# EAGLE design NESv23 (EAGLE 5.11)
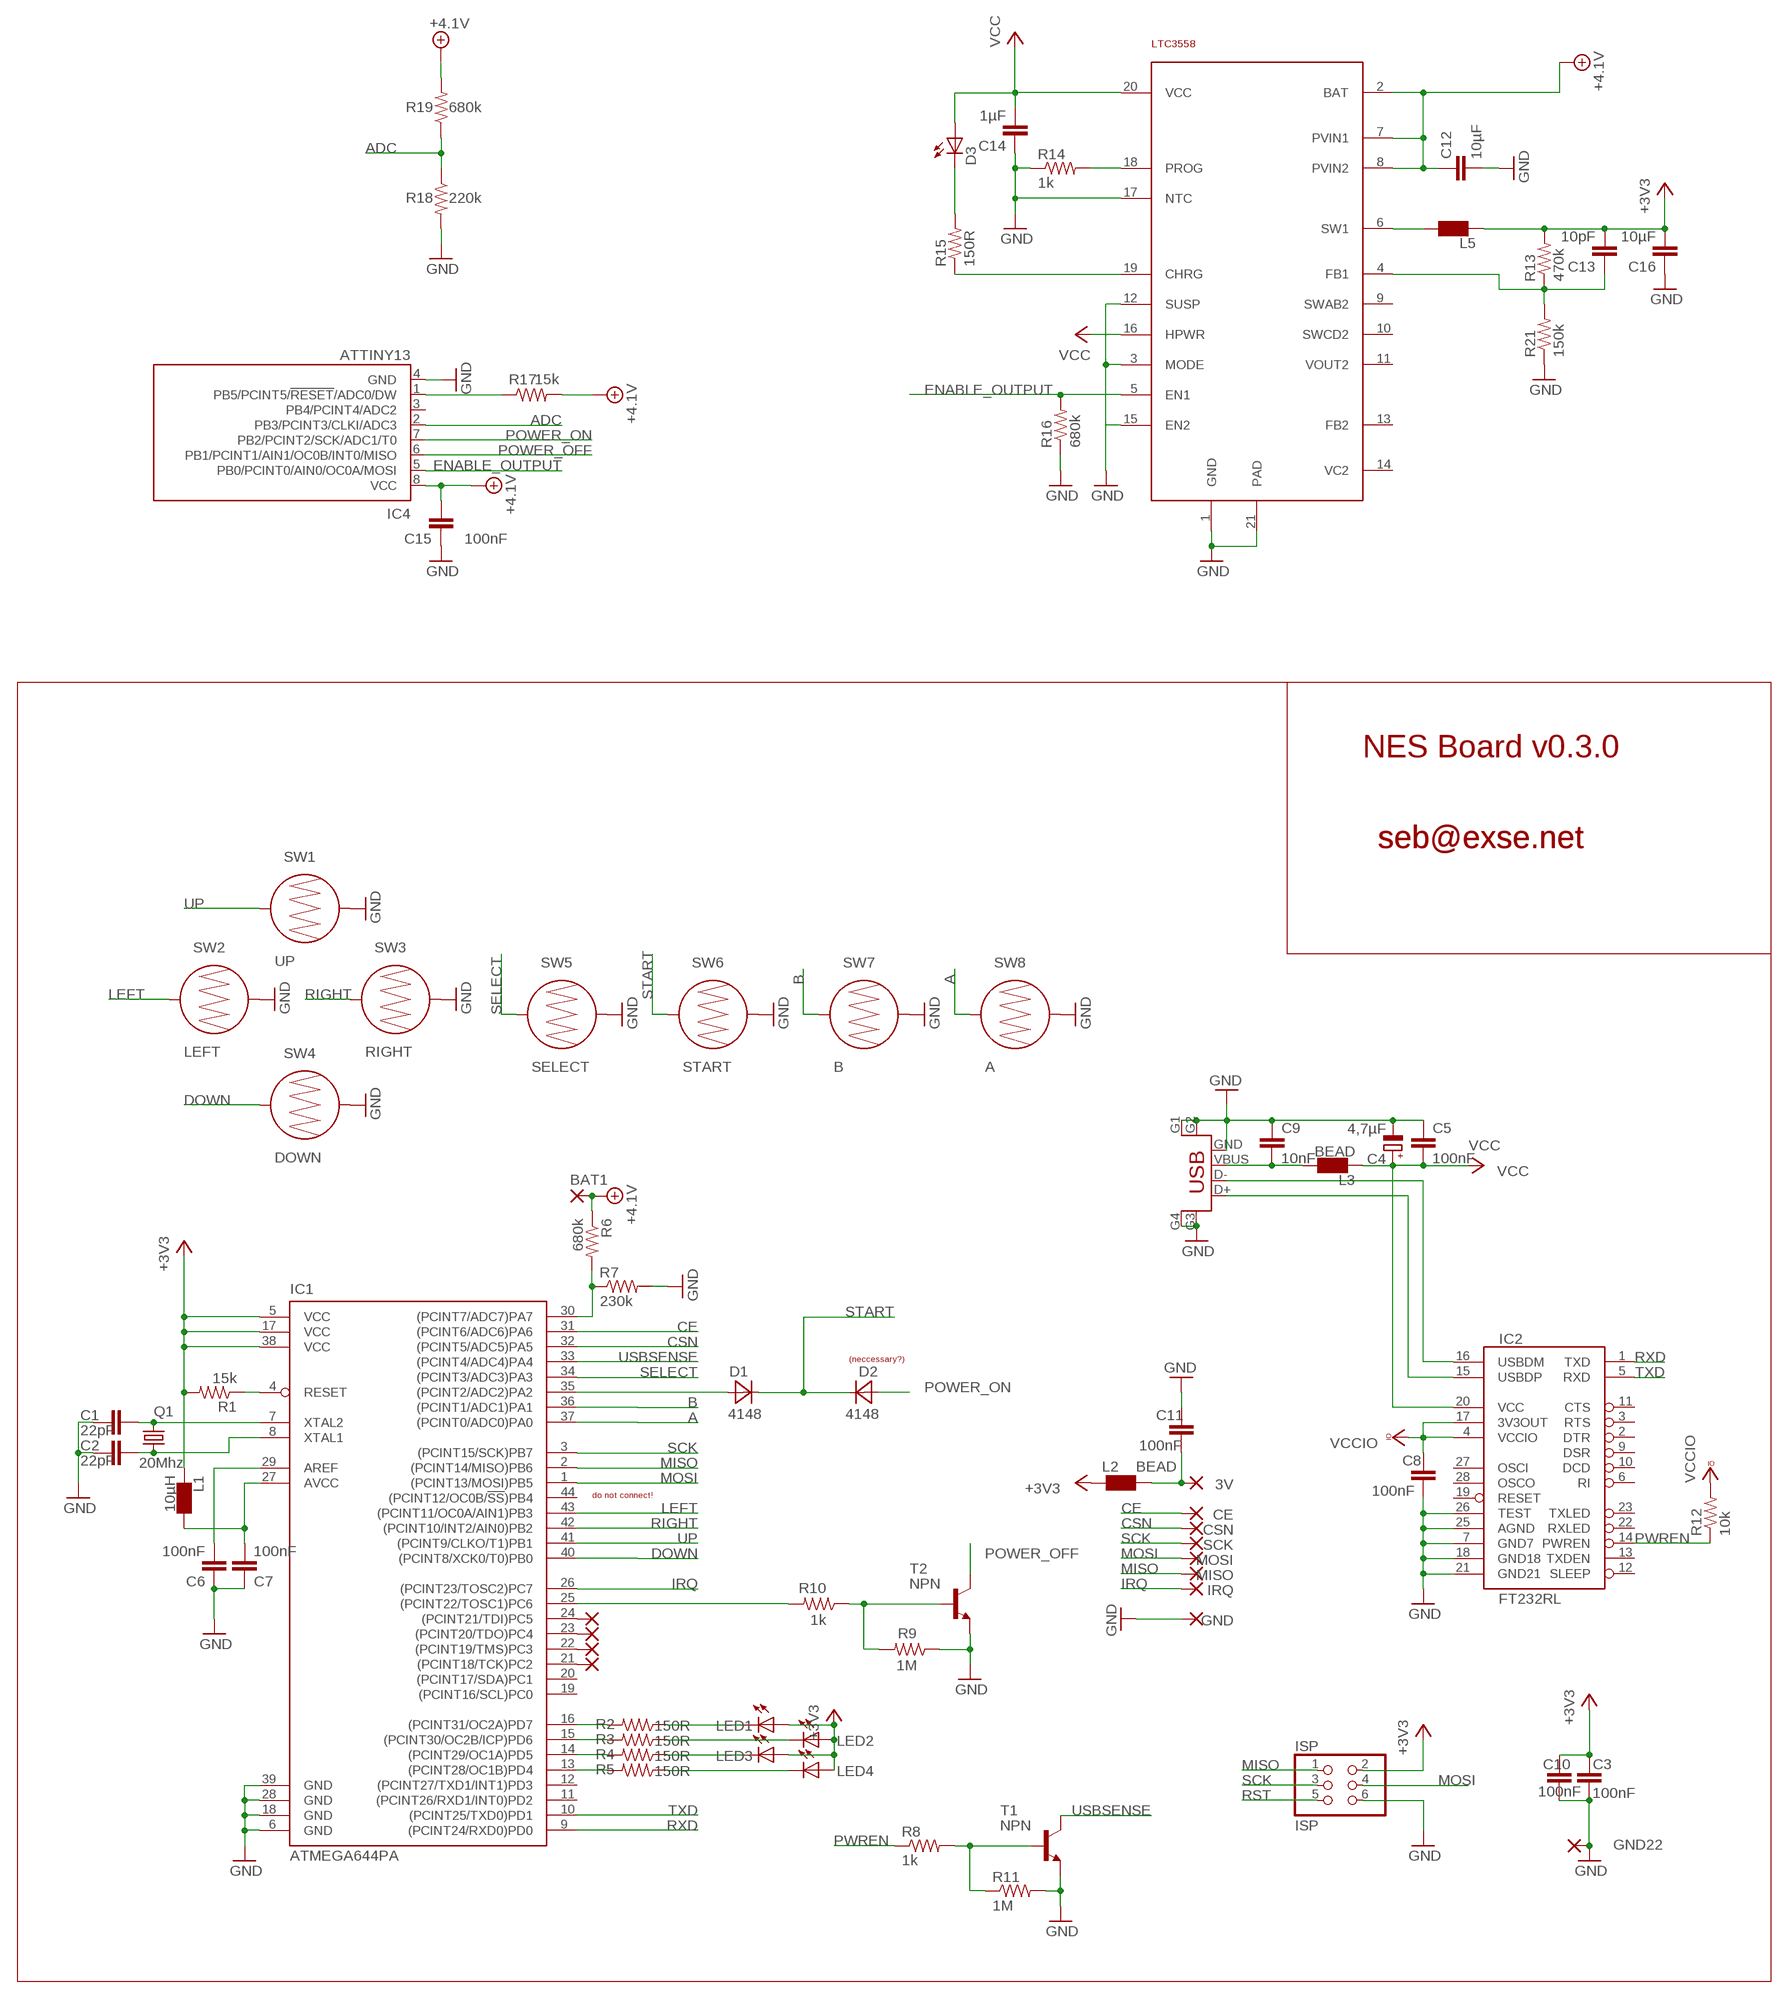
[diagram p0: schematic, sheet 1]

## Parts
3V  SMD2  [SMD1,27-2,54]
BAT1  SMD2  [SMD1,27-2,54]
C1  22pF  CAP0805  [0805]
C2  22pF  CAP0805  [0805]
C3  100nF  CAP0805  [0805]
C4  4,7µF  CPOL-EUSMCC  [SMC_C]
C5  100nF  CAP0805  [0805]
C6  100nF  CAP0805  [0805]
C7  100nF  CAP0805  [0805]
C8  100nF  CAP0805  [0805]
C9  10nF  CAP0805  [0805]
C10  100nF  CAP0805  [0805]
C11  100nF  CAP0805  [0805]
C12  10µF  CAP0805  [0805]
C13  10pF  CAP0805  [0805]
C14  1µF  CAP0805  [0805]
C15  100nF  CAP0805  [0805]
C16  10µF  CAP0805  [0805]
CE  SMD2  [SMD1,27-2,54]
CSN  SMD2  [SMD1,27-2,54]
D1  4148  DIODE_0805  [DIODE_0805]
D2  4148  DIODE_0805  [DIODE_0805]
D3  LEDCHIPLED_0805  [CHIPLED_0805]
GND  SMD2  [SMD1,27-2,54]
GND22  SMD2  [SMD1,27-2,54]
IC1  ATMEGA644PA  [TQFP44]
IC2  FT232RL  FT232RLSSOP  [SSOP28DB]
IC3  LTC3558  [UD-QFN20]
IC4  ATTINY13  TINY13-20SSU  [8S1]
IRQ  SMD2  [SMD1,27-2,54]
ISP  ISP  PINHD-2X03_2.54  [2X03]
L1  10µH  L0805  [0805]
L2  BEAD  [0805]
L3  BEAD  [0805]
L5  VLF4012A  [VLF4012A]
LED1  LED3MM  [LED3MM]
LED2  LED3MM  [LED3MM]
LED3  LED3MM  [LED3MM]
LED4  LED3MM  [LED3MM]
MISO  SMD2  [SMD1,27-2,54]
MOSI  SMD2  [SMD1,27-2,54]
PAD1  SMD2  [SMD1,27-2,54]
PAD2  SMD2  [SMD1,27-2,54]
PAD3  SMD2  [SMD1,27-2,54]
PAD4  SMD2  [SMD1,27-2,54]
Q1  20Mhz  X22-OSCILLATOR  [X22]
R1  15k  RESISTOR0805-RES  [0805]
R2  150R  RESISTOR0805-RES  [0805]
R3  150R  RESISTOR0805-RES  [0805]
R4  150R  RESISTOR0805-RES  [0805]
R5  150R  RESISTOR0805-RES  [0805]
R6  680k  RESISTOR0805-RES  [0805]
R7  230k  RESISTOR0805-RES  [0805]
R8  1k  RESISTOR0805-RES  [0805]
R9  1M  RESISTOR0805-RES  [0805]
R10  1k  RESISTOR0805-RES  [0805]
R11  1M  RESISTOR0805-RES  [0805]
R12  10k  RESISTOR0805-RES  [0805]
R13  470k  RESISTOR0402-RES  [0402-RES]
R14  1k  RESISTOR0402-RES  [0402-RES]
R15  150R  RESISTOR0402-RES  [0402-RES]
R16  680k  RESISTOR0402-RES  [0402-RES]
R17  15k  RESISTOR0402-RES  [0402-RES]
R18  220k  RESISTOR0402-RES  [0402-RES]
R19  680k  RESISTOR0402-RES  [0402-RES]
R21  150k  RESISTOR0402-RES  [0402-RES]
SCK  SMD2  [SMD1,27-2,54]
SW1  UP  BUTTON-CONDUCTIVESMD  [BUTTON-CONDUCTIVE]
SW2  LEFT  BUTTON-CONDUCTIVESMD  [BUTTON-CONDUCTIVE]
SW3  RIGHT  BUTTON-CONDUCTIVESMD  [BUTTON-CONDUCTIVE]
SW4  DOWN  BUTTON-CONDUCTIVESMD  [BUTTON-CONDUCTIVE]
SW5  SELECT  BUTTON-CONDUCTIVESMD  [BUTTON-CONDUCTIVE]
SW6  START  BUTTON-CONDUCTIVESMD  [BUTTON-CONDUCTIVE]
SW7  B  BUTTON-CONDUCTIVESMD  [BUTTON-CONDUCTIVE]
SW8  A  BUTTON-CONDUCTIVESMD  [BUTTON-CONDUCTIVE]
T1  NPN  BC847  [SOT23]
T2  NPN  BC847  [SOT23]
X1  USB-SMD-NS  [USB-MINIB-NOSTOP]

## Nets
+3V3: C3.1 C10.1 C13.2 C16.2 IC1.5(VCC) IC1.17(VCC) IC1.38(VCC) ISP.2 L1.2 L2.1 L5.P$4 LED1.A LED2.A LED3.A LED4.A R1.2 R13.2
+4.1V: BAT1.1(P) C12.1 C15.2 IC3.2(BAT) IC3.7(PVIN1) IC3.8(PVIN2) IC4.8(VCC) R6.1 R17.2 R19.2
A: IC1.37((PCINT0/ADC0)PA0) SW8.1
ADC: IC4.2(PB3/PCINT3/CLKI/ADC3) R18.1 R19.1
B: IC1.36((PCINT1/ADC1)PA1) SW7.1
CE: CE.1(P) IC1.31((PCINT6/ADC6)PA6)
CSN: CSN.1(P) IC1.32((PCINT5/ADC5)PA5)
DOWN: IC1.40((PCINT8/XCK0/T0)PB0) SW4.1
ENABLE_OUTPUT: IC3.5(EN1) IC4.5(PB0/PCINT0/AIN0/OC0A/MOSI) R16.2
GND: C1.1 C2.1 C3.2 C4.- C5.1 C6.2 C7.2 C8.2 C9.1 C10.2 C11.1 C12.2 C14.1 C15.1 C16.1 GND22.1(P) GND.1(P) IC1.6(GND) IC1.18(GND) IC1.28(GND) IC1.39(GND) IC2.7(GND7) IC2.18(GND18) IC2.21(GND21) IC2.25(AGND) IC2.26(TEST) IC3.1(GND) IC3.3(MODE) IC3.12(SUSP) IC3.15(EN2) IC3.17(NTC) IC3.21(PAD) IC4.4(GND) ISP.6 R7.2 R9.1 R11.2 R14.1 R16.1 R18.2 R21.1 SW1.2 SW2.2 SW3.2 SW4.2 SW5.2 SW6.2 SW7.2 SW8.2 T1.2(E) T2.2(E) X1.G1(GND) X1.G2(GND) X1.G3(GND) X1.G4(GND) X1.GND
IRQ: IC1.26((PCINT23/TOSC2)PC7) IRQ.1(P)
LEFT: IC1.43((PCINT11/OC0A/AIN1)PB3) SW2.1
MISO: IC1.2((PCINT14/MISO)PB6) ISP.1 MISO.1(P)
MOSI: IC1.1((PCINT13/MOSI)PB5) ISP.4 MOSI.1(P)
N$1: R9.2 R10.1 T2.1(B)
N$2: C2.2 IC1.8(XTAL1) Q1.1
N$3: C1.2 IC1.7(XTAL2) Q1.3
N$4: IC1.13((PCINT28/OC1B)PD4) R5.2
N$5: IC1.14((PCINT29/OC1A)PD5) R4.2
N$6: IC1.15((PCINT30/OC2B/ICP)PD6) R3.2
N$7: IC1.16((PCINT31/OC2A)PD7) R2.2
N$8: LED1.K(C) R2.1
N$9: LED2.K(C) R3.1
N$10: LED3.K(C) R4.1
N$11: LED4.K(C) R5.1
N$12: IC1.25((PCINT22/TOSC1)PC6) R10.2
N$13: C7.1 IC1.27(AVCC) L1.1
N$14: 3V.1(P) C11.2 L2.2
N$15: D1.2(A) IC1.35((PCINT2/ADC2)PA2)
N$17: IC1.30((PCINT7/ADC7)PA7) R6.2 R7.1
N$18: R8.2 R11.1 T1.1(B)
N$19: IC2.16(USBDM) X1.D-
N$20: C6.1 IC1.29(AREF)
N$21: C9.2 L3.1 X1.VBUS
N$22: IC2.15(USBDP) X1.D+
N$25: IC1.24((PCINT21/TDI)PC5) PAD1.1(P)
N$26: IC1.23((PCINT20/TDO)PC4) PAD2.1(P)
N$27: IC1.22((PCINT19/TMS)PC3) PAD3.1(P)
N$28: IC1.21((PCINT18/TCK)PC2) PAD4.1(P)
N$30: IC3.18(PROG) R14.2
N$31: IC3.19(CHRG) R15.1
N$32: D3.C R15.2
N$33: IC4.1(PB5/PCINT5/!RESET!/ADC0/DW) R17.1
N$35: C13.1 IC3.4(FB1) R13.1 R21.2
N$36: IC3.6(SW1) L5.P$3
POWER_OFF: IC4.6(PB1/PCINT1/AIN1/OC0B/INT0/MISO) T2.3(C)
POWER_ON: D2.2(A) IC4.7(PB2/PCINT2/SCK/ADC1/T0)
PWREN: IC2.14(PWREN) R8.1 R12.1
RIGHT: IC1.42((PCINT10/INT2/AIN0)PB2) SW3.1
RST: IC1.4(RESET) ISP.5 R1.1
RXD: IC1.9((PCINT24/RXD0)PD0) IC2.1(TXD)
SCK: IC1.3((PCINT15/SCK)PB7) ISP.3 SCK.1(P)
SELECT: IC1.34((PCINT3/ADC3)PA3) SW5.1
START: D1.1(C) D2.1(C) SW6.1
TXD: IC1.10((PCINT25/TXD0)PD1) IC2.5(RXD)
UP: IC1.41((PCINT9/CLKO/T1)PB1) SW1.1
USBSENSE: IC1.33((PCINT4/ADC4)PA4) T1.3(C)
VCC: C4.+ C5.2 C14.2 D3.A IC2.20(VCC) IC3.16(HPWR) IC3.20(VCC) L3.2
VCCIO: C8.1 IC2.4(VCCIO) IC2.17(3V3OUT) R12.2
Unconnected: IC1.11((PCINT26/RXD1/INT0)PD2) IC1.12((PCINT27/TXD1/INT1)PD3) IC1.19((PCINT16/SCL)PC0) IC1.20((PCINT17/SDA)PC1) IC1.44((PCINT12/OC0B/!SS!)PB4) IC2.2(DTR) IC2.3(RTS) IC2.6(RI) IC2.9(DSR) IC2.10(DCD) IC2.11(CTS) IC2.12(SLEEP) IC2.13(TXDEN) IC2.19(RESET) IC2.22(RXLED) IC2.23(TXLED) IC2.27(OSCI) IC2.28(OSCO) IC3.9(SWAB2) IC3.10(SWCD2) IC3.11(VOUT2) IC3.13(FB2) IC3.14(VC2) IC4.3(PB4/PCINT4/ADC2)

## Notes on the sheet
- NES Board v0.3.0
- seb@exse.net | seb@exse.net
- (neccessary?)
- do not connect!

## Library data of the parts
3V BAT1 CE CSN GND GND22 IRQ MISO MOSI PAD1-PAD4 SCK = wirepad:SMD2: SMD PAD
C1-C3 C5-C16 = SparkFun:CAP: Capacitor Standard 0603 ceramic capacitor, and 0.1" leaded capacitor.
C4 = rcl:CPOL-EU: POLARIZED CAPACITOR, European symbol
D1 D2 = seb:DIODE_0805
D3 = led:LED: LED OSRAM: - CHIPLED LG R971, LG N971, LY N971, LG Q971, LY Q971, LO R971, LY R971 LH N974, LH R974 LS Q976, LO Q976, LY Q976 LO Q996 - Hyper CHIPLED LW Q18S LB Q993, LB Q99A, LB R99A - SideLED LS A670, LO A670, LY A670, LG A670, LP A670 LB A673, LV A673, LT A673, LW A673 LH A674 LY A675 LS A676, LA A676, LO A676, LY A676, LW A676 LS A679, LY A679, LG A679 - Hyper Micro SIDELED® LS Y876, LA Y876, LO Y876, LY Y876 LT Y87S - SmartLED LW L88C, LW L88S LB L89C, LB L89S, LG L890 LS L89K, LO L89K, LY L89K LS L896, LA L896, LO L896, LY L896 - TOPLED LS T670, LO T670, LY T670, LG T670, LP T670 LSG T670, LSP T670, LSY T670, LOP T670, LYG T670 LG T671, LOG T671, LSG T671 LB T673, LV T673, LT T673, LW T673 LH T674 LS T676, LA T676, LO T676, LY T676, LB T676, LH T676, LSB T676, LW T676 LB T67C, LV T67C, LT T67C, LS T67K, LO T67K, LY T67K, LW E67C LS E67B, LA E67B, LO E67B, LY E67B, LB E67C, LV E67C, LT E67C LW T67C LS T679, LY T679, LG T679 LS T770, LO T770, LY T770, LG T770, LP T770 LB T773, LV T773, LT T773, LW T773 LH T774 LS E675, LA E675, LY E675, LS T675 LS T776, LA T776, LO T776, LY T776, LB T776 LHGB T686 LT T68C, LB T68C - Hyper Mini TOPLED® LB M676 - Mini TOPLED Santana® LG M470 LS M47K, LO M47K, LY M47K Source: http://www.osram.convergy.de LUXEON: - LUMILED® LXK2-PW12-R00, LXK2-PW12-S00, LXK2-PW14-U00, LXK2-PW14-V00 LXK2-PM12-R00, LXK2-PM12-S00, LXK2-PM14-U00 LXK2-PE12-Q00, LXK2-PE12-R00, LXK2-PE12-S00, LXK2-PE14-T00, LXK2-PE14-U00 LXK2-PB12-K00, LXK2-PB12-L00, LXK2-PB12-M00, LXK2-PB14-N00, LXK2-PB14-P00, LXK2-PB14-Q00 LXK2-PR12-L00, LXK2-PR12-M00, LXK2-PR14-Q00, LXK2-PR14-R00 LXK2-PD12-Q00, LXK2-PD12-R00, LXK2-PD12-S00 LXK2-PH12-R00, LXK2-PH12-S00 LXK2-PL12-P00, LXK2-PL12-Q00, LXK2-PL12-R00 Source: www.luxeon.com KINGBRIGHT: KA-3528ASYC Source: www.kingbright.com
IC1 = seb:ATMEGA644PA
IC2 = SparkFun:FT232RL: USB UART FT232RL 4th Generation USB UART (USB <-> Serial) Controller. Spark Fun Electronics SKU : COM-00650
IC3 = seb:LTC3558
IC4 = atmel:TINY13: 8-bit AVR Microcontroller with 1K Bytes In-System Programmable Flash Source: http://www.atmel.com/dyn/resources/prod_documents/2535S.pdf; MPN: ATTINY13-20SSU; OC_FARNELL: 1455133; OC_NEWARK: 58M3771
ISP = pinhead-2:PINHD-2X03: PIN HEADER
L1 = seb:L0805
L2 L3 = seb:BEAD
L5 = seb:VLF4012A
LED1-LED4 = SparkFun:LED: LEDs Standard schematic elements and footprints for 5mm, 3mm, 1206, and 0603 sized LEDs. 5mm - Spark Fun Electronics SKU : COM-00529 (and others)
Q1 = seb:X22-OSCILLATOR
R1-R19 R21 = SparkFun:RESISTOR: Resistor Basic schematic elements and footprints for 0603, 1206, and PTH resistors.
SW1-SW8 = SparkFun:BUTTON-CONDUCTIVE: Conductive Button Used with rubber key pads. This one was designed and proven to work with the PolyCase Key FOB enclosures.
T1 T2 = transistor:BC847: NPN TRANSISTOR
X1 = SparkFun:USB: USB Connectors USB-B-PTH is fully proven SKU : PRT-00139 USB-miniB is fully proven SKU : PRT-00587 USB-A-PCB is untested. USB-A-H is throughly reviewed, but untested. Spark Fun Electronics SKU : PRT-00437 USB-B-SMT is throughly reviewed, but untested. Needs silkscreen touching up. USB-A-S has not been used/tested USB-MB-H has not been used/tested

## Board
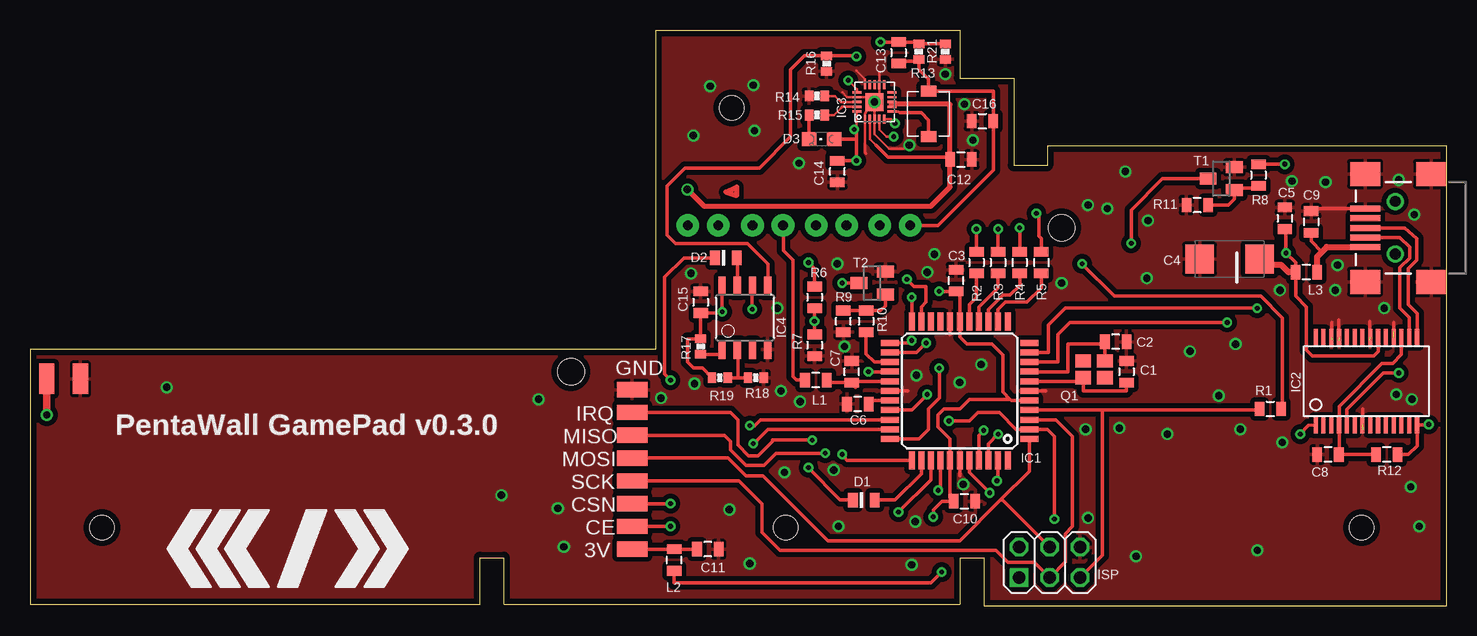
[diagram p1: board, top side]
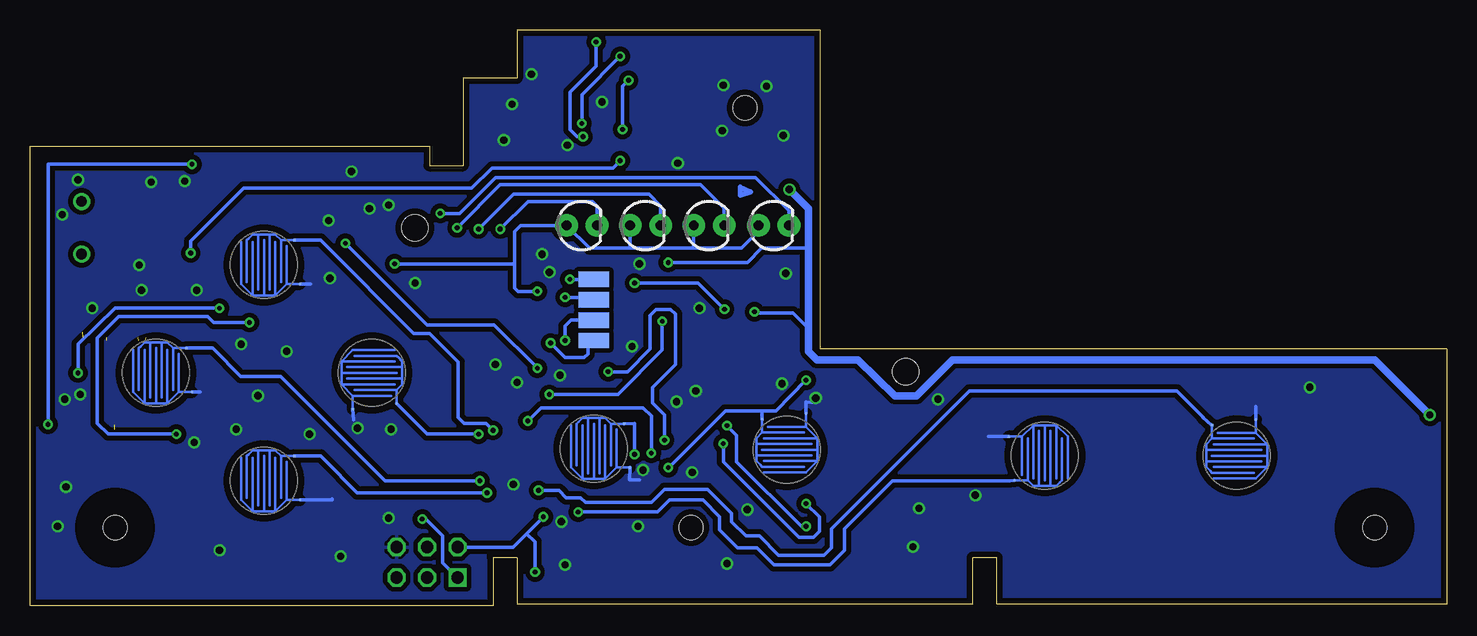
[diagram p2: board, bottom side, seen from below]

Size 118.1 x 48 mm. Coordinates in mm from the lower left corner, seen from the top.
Outline: 0,0.1 37.5,0.1 37.5,4 39.5,4 39.5,0.1 77.5,0.1 77.5,4 79.5,4 79.5,0 118.1,0 118.1,38.3 84.8,38.3 84.8,36.7 82,36.7 82,44 77.5,44 77.5,48 52.2,48 52.2,21.4 0,21.4 0,0.1
Copper layers (1*16): Top 0.035mm / dielectric 1.5mm / Bottom 0.035mm
Design rules "default *": minimum track width 10mil, minimum drill 0.3mm, track to track 8mil, track to pad 8mil, pad to pad 8mil, via to via 8mil, smd to smd 8mil, copper to edge 20mil, drill to drill 8mil, minimum pad ring 10mil, minimum via ring 8mil, stop-mask expansion 4mil, vias tented up to drill 0.6mm, thermal gap 10mil
Holes 2 mm at 6,6.5 63,6.5 111,6.5 58.5,41.5
Holes 2.2 mm at 86,31.5 45.1,19.5
tKeepout: area 95.6,16.4 to 101.6,22.4; area 21.6,11.5 to 27.6,17.5; area 59.9,3.5 to 65.9,9.5; area 107.9,3.5 to 113.9,9.5; area 55.5,38.5 to 61.5,44.5; area 3.1,3.4 to 9.1,9.4
bKeepout: area 61.6,5.1 to 64.4,7.9; area 57.1,40.1 to 59.9,42.9; area 43.7,18.2 to 46.5,21; area 84.4,30 to 87.2,32.8
tRestrict: 1 lines
bRestrict: area 109.6,5.1 to 112.4,7.9; area 4.6,5.1 to 7.4,7.9

### Footprints (pad centres in the part's own frame; a part is rotated, then mirrored left to right if it is on the bottom)
SMD1,27-2,54 = smd 1.27 x 2.54: 1 0,0
0805 = smd 0.8 x 1.2: 1 -0.9,0; 2 0.9,0
SMC_C = smd 2.4 x 2.4: + -2.5,0; - 2.5,0
DIODE_0805 = smd 0.8 x 1.2: 1 -0.9,0; 2 0.9,0
CHIPLED_0805 = smd 1.2 x 1.2: A 0,-1.05; C 0,1.05
TQFP44 = smd 1.5 x 0.5: 1 -5.8,4; 2 -5.8,3.2; 3 -5.8,2.4; 4 -5.8,1.6; 5 -5.8,0.8; 6 -5.8,0; 7 -5.8,-0.8; 8 -5.8,-1.6; 9 -5.8,-2.4; 10 -5.8,-3.2; 11 -5.8,-4; 23 5.8,-4; 24 5.8,-3.2; 25 5.8,-2.4; 26 5.8,-1.6; 27 5.8,-0.8; 28 5.8,0; 29 5.8,0.8; 30 5.8,1.6; 31 5.8,2.4; 32 5.8,3.2; 33 5.8,4 | smd 0.5 x 1.5: 12 -4,-5.8; 13 -3.2,-5.8; 14 -2.4,-5.8; 15 -1.6,-5.8; 16 -0.8,-5.8; 17 0,-5.8; 18 0.8,-5.8; 19 1.6,-5.8; 20 2.4,-5.8; 21 3.2,-5.8; 22 4,-5.8; 34 4,5.8; 35 3.2,5.8; 36 2.4,5.8; 37 1.6,5.8; 38 0.8,5.8; 39 0,5.8; 40 -0.8,5.8; 41 -1.6,5.8; 42 -2.4,5.8; 43 -3.2,5.8; 44 -4,5.8
SSOP28DB = smd 0.348 x 1.397: 1 -4.225,-3.656; 2 -3.575,-3.656; 3 -2.925,-3.656; 4 -2.275,-3.656; 5 -1.625,-3.656; 6 -0.975,-3.656; 7 -0.325,-3.656; 8 0.325,-3.656; 9 0.975,-3.656; 10 1.625,-3.656; 11 2.275,-3.656; 12 2.925,-3.656; 13 3.575,-3.656; 14 4.225,-3.656; 15 4.225,3.656; 16 3.575,3.656; 17 2.925,3.656; 18 2.275,3.656; 19 1.625,3.656; 20 0.975,3.656; 21 0.325,3.656; 22 -0.325,3.656; 23 -0.975,3.656; 24 -1.625,3.656; 25 -2.275,3.656; 26 -2.925,3.656; 27 -3.575,3.656; 28 -4.225,3.656
UD-QFN20 = smd 0.751 x 0.2: 1 -1.451,0.8; 2 -1.451,0.4; 3 -1.451,0; 4 -1.451,-0.4; 5 -1.451,-0.8; 11 1.451,-0.8; 12 1.451,-0.4; 13 1.451,0; 14 1.451,0.4; 15 1.451,0.8 | smd 0.2 x 0.751: 6 -0.8,-1.451; 7 -0.4,-1.451; 8 0,-1.451; 9 0.4,-1.451; 10 0.8,-1.451; 16 0.8,1.451; 17 0.4,1.451; 18 0,1.451; 19 -0.4,1.451; 20 -0.8,1.451 | smd 1.5 x 1.5: 21 0,0
8S1 = smd 0.6 x 1.6: 1 -1.905,-2.654; 2 -0.645,-2.654; 3 0.625,-2.654; 4 1.895,-2.654; 5 1.905,2.654; 6 0.635,2.654; 7 -0.635,2.654; 8 -1.905,2.654
2X03 = drill 1.016 square: 1 -2.54,-1.27 | drill 1.016 octagon: 2 -2.54,1.27; 3 0,-1.27; 4 0,1.27; 5 2.54,-1.27; 6 2.54,1.27
VLF4012A = smd 0.9 x 1.3: P$3 -1.9,0; P$4 1.9,0
LED3MM = drill 0.813 pad 1.88 round: A -1.27,0; K 1.27,0
X22 = smd 1.3 x 1.1: 1 0.9,0.7; 2 -0.9,0.7; 3 -0.9,-0.7; 4 0.9,-0.7
0402-RES = smd 0.7 x 0.9: 1 -0.65,0; 2 0.65,0
BUTTON-CONDUCTIVE = smd 0.203 x 0.203: 1 2.54,2.064; 2 3.016,-1.587
SOT23 = smd 1 x 1.4: 1 -0.95,-1.1; 2 0.95,-1.1; 3 0,1.1
USB-MINIB-NOSTOP = smd 2.5 x 0.5: D+ 2.5,0; D- 2.5,0.8; GND 2.5,-1.6; ID 2.5,-0.8; VBUS 2.5,1.6 | smd 2.5 x 2: G1 -3,-4.5; G2 -3,4.5; G3 2.5,4.5; G4 2.5,-4.5 | drill 0.9 pad 0.8 round: H1 0,2.2 | drill 0.9 pad 0.787 round: H2 0,-2.2

### Placement (x,y rotation side)
3V  50.2,4.7 90 top
BAT1  1.4,18.9 0 top
C1  91.4,19.5 270 top
C2  90.5,22 180 top
C3  77.2,27.1 90 top
C4  100,28.9 180 top
C5  104.6,32.3 270 top
C6  69,16.8 180 top
C7  68.5,19.5 90 top
C8  108.2,12.6 180 top
C9  106.8,32 270 top
C10  77.9,8.7 0 top
C11  56.5,4.7 180 top
C12  77.6,37.2 0 top
C13  72.4,46.1 270 top
C14  67.3,36.2 90 top
C15  55.9,25.3 270 top
C16  79.4,40.4 0 top
CE  50.2,6.6 90 top
CSN  50.2,8.5 90 top
D1  69.5,8.8 0 top
D2  58,29 0 top
D3  66,38.9 90 top
GND  50.2,18 90 top
GND22  4.2,18.9 0 top
IC1  77.5,17.9 180 top
IC2  111.4,18.7 0 top
IC3  70.4,42 90 top
IC4  59.6,24 0 top
IRQ  50.2,16.1 90 top
ISP  85,3.6 0 top
L1  65.5,18.8 180 top
L2  53.7,3.8 90 top
L3  106.4,27.8 180 top
L5  74.9,41 90 top
LED1  72.1,31.7 0 bottom
LED2  66.8,31.7 0 bottom
LED3  61.5,31.7 0 bottom
LED4  56.1,31.7 0 bottom
MISO  50.2,14.2 90 top
MOSI  50.2,12.3 90 top
PAD1  71.1,22.1 90 bottom
PAD2  71.1,23.8 90 bottom
PAD3  71.1,25.5 90 bottom
PAD4  71.1,27.2 90 bottom
Q1  88.7,19.7 0 top
R1  103.4,16.4 0 top
R2  78.9,28.6 270 top
R3  80.7,28.6 270 top
R4  82.5,28.6 270 top
R5  84.3,28.6 270 top
R6  65.4,25.7 270 top
R7  65.4,21.7 270 top
R8  102.4,35.9 270 top
R9  67.8,23.7 90 top
R10  69.7,23.7 270 top
R11  97.3,33.4 180 top
R12  113.1,12.6 180 top
R13  74.1,46.2 270 top
R14  65.6,42.5 0 top
R15  65.6,40.9 180 top
R16  66.4,45.2 90 top
R17  55.9,21.6 90 top
R18  60.5,19 0 top
R19  57.5,19 180 top
R21  76.3,46.2 90 top
SCK  50.2,10.4 90 top
SW1  98.6,28.4 0 bottom
SW2  107.6,19.4 0 bottom
SW3  89.6,19.4 270 bottom
SW4  98.6,10.4 0 bottom
SW5  71.1,13.1 0 bottom
SW6  55,13 90 bottom
SW7  33.5,12.5 180 bottom
SW8  17.5,12.5 90 bottom
T1  99.3,35.6 90 top
T2  70.2,26.9 90 top
X1  113.8,31.5 180 top

### Tracks (layer width: path | path; a pad name or v marks a point on that pad's centre or on a via)
+3V3  (via drill 0.4)
  Top 0.305: v75.8,26.2 C3.1 77.5,25.9 IC1.17 77.5,22.4 78.1,21.8 80.2,21.8 81.1,20.9 81.1,17.8 81.7,17.2 | 104.4,16.4 R1.2 104.4,16.5 104.4,24 102.6,25.8 90.4,25.8 v87.7,28.5 | IC1.5 81.8,17.1 81.7,17.2 | 81.7,17.2 78.3,17.2 77.5,16.4 76.2,16.4 75.7,15.9 75.7,14.9 76.7,13.9 IC1.38 76.7,9 C10.1 76,8.7 75.3,8 v75.3,7.4 | L1.2 63.9,18.8 63.6,19.1 63.6,28.8 62.8,29.6 62.8,31.1 62.77,31.13 LED3.A | LED1.A 75.7,31.7 80.3,36.3 C16.2 80.3,42.9 L5.P$4 74.9,43.9 74.1,44.7 R13.2 73.95,45.4 72.6,45.4 C13.2 | L2.1 53.7,1.9 75.1,1.9 v76,2.8
  Bottom 0.305: 68.1,29.8 71.47,29.8 LED1.A 77.2,31.7 77.7,31.2 77.7,28.5 | 68.1,29.8 62.8,29.8 | 62.8,29.8 58.8,29.8 57.37,31.23 LED4.A | LED3.A 62.8,31.33 62.8,29.8 | LED2.A 68.1,31.37 68.1,29.8 | v75.8,26.2 77.4,26.2 77.7,26.5 77.7,28.5 | 77.7,28.5 v87.7,28.5 | 76.7,6 v75.3,7.4 | 76.7,6 77.83,4.87 ISP.2 | v76,2.8 76,5.3 76.7,6
+4.1V  (via drill 0.4, 0.6)
  Top 0.2: IC3.8 72.1,42 72.1,41.6 | 72.1,41.6 IC3.7 | 71.8,41.8 72.1,41.6 | 70.5,38.4 70,38.9 IC3.2
  Top 0.305: R6.1 65.4,28.1 v64.9,28.6 | 70.5,38.4 71.5,37.4 76.5,37.4 C12.1 | v57.7,24.5 57.7,24.4 C15.2 R17.2 54.8,22.25 54.8,20.3 55.3,19.8 56.05,19.8 R19.2 | v57.7,24.5 IC4.8 | v57.7,24.5
  Top 0.406: 71.8,41.8 76.7,41.8 C12.1 76.7,34.9 75.1,33.3 56.2,33.3 v54.8,34.7
  Top 0.61: v1.4,15.9 BAT1.1
  Bottom 0.305: v64.9,28.6 58.3,28.6 57.1,29.8 53.3,29.8 53.2,29.9 | 53.2,21.2 53.2,23.1 54.5,24.4 57.6,24.4 v57.7,24.5
  Bottom 0.61: v1.4,15.9 6,20.5 41.2,20.5 44.2,17.5 46,17.5 49.1,20.5 52.5,20.5 53.2,21.2 53.2,29.9 53.2,33.1 v54.8,34.7
A  (via drill 0.4)
  Top 0.305: v75.7,9.6 75.9,9.9 IC1.37
  Bottom 0.305: SW8.1 20.32,15.7 20.3,15.7 22.5,17.9 39.8,17.9 51.3,6.4 51.3,4.8 51.9,4.2 55.7,4.2 57.3,5.8 58.4,5.8 59.6,7 59.6,7.7 61.6,9.7 65.2,9.7 66.3,8.6 71.8,8.6 72.2,9 73.4,9 74,9.6 v75.7,9.6
ADC
  Top 0.305: R19.1 59,19 | 59,19 R18.1 | IC4.2 59,21.35 59,19
B  (via drill 0.4)
  Top 0.305: IC1.36 75.1,10.5 v72.4,7.8
  Bottom 0.305: SW7.1 36.42,10.4 46.2,10.4 50.2,6.4 50.2,4.6 51.4,3.4 56.1,3.4 57.5,4.8 59.1,4.8 60.6,6.3 60.6,7.4 62,8.8 64.8,8.8 65.8,7.8 v72.4,7.8
CE  (via drill 0.4)
  Top 0.305: IC1.31 60.9,15.5 60.4,15 v60,15 | CE.1 v53.4,6.6
  Bottom 0.305: v60,15 59.2,14.2 59.2,12 53.8,6.6 v53.4,6.6
CSN  (via drill 0.4)
  Top 0.305: IC1.32 61.5,14.7 v60.3,13.5 | CSN.1 v53.4,8.5
  Bottom 0.305: v60.3,13.5 60.3,12 54,5.7 52.8,5.7 52.3,6.2 52.3,7.4 v53.4,8.5
DOWN  (via drill 0.4)
  Top 0.305: IC1.40 78.3,11.1 v80,9.4
  Bottom 0.305: SW4.1 93.86,12.46 93.6,12.2 90.82,9.4 v80,9.4
ENABLE_OUTPUT  (via drill 0.4)
  Top 0.2: IC3.5 71.75,40.55 v72.1,40.2
  Top 0.305: v68.9,45.8 68.85,45.85 66.9,45.85 R16.2 64.55,45.85 63.4,44.7 63.4,39.1 60.8,36.5 54.6,36.5 53.1,35 53.1,30.9 53.8,30.2 59.8,30.2 61.51,28.5 IC4.5
  Bottom 0.305: v72.1,40.2 72.1,42.6 v68.9,45.8
GND  (via drill 0.6)  (5 unrouted)
  Top 0.2: IC3.21 IC3.3 70.4,39.3 71.6,38.1 72.8,38.1 | IC3.21 70.8,42.4 IC3.12 70.8,44.45 | IC3.21 70,42.4 IC3.17 68.1,42.4 67.75,42.8 | 69.6,39.55 69.6,37.8 69.7,37.7 | 69.6,39.55 IC3.1 | IC3.15 69.6,43.9 68.9,44.6 | 69.6,39.55 69.6,41 | 69.61,41.01 70.33,42.26
  Top 0.305: 107.1,33.1 X1.GND | 71.6,17.9 IC1.28 73.2,17.9 | 76.7,23.9 IC1.18 76.7,22.6 | IC1.6 84.7,17.9 | IC1.39 77.5,10.8 | 108.5,22.2 108.5,23.6 | 109.1,22.1 109.1,23.8 | 111.7,22.1 111.7,23.7 | 113.7,22.8 113.7,23.6 | 111.1,14.7 111.1,16.4
  Bottom 0.305: SW4.2 92.92,8.8 92.9,8.9 | SW1.2 94.7,26.8 | SW5.2 68.12,10.5 67.3,10.5 | SW6.2 53.4,17 52.6,16.9 | SW7.2 38.2,14.1 38.1,14.1 | SW8.2 15.9,16.1 15.9,16.6 | 91.14,15.46 SW3.2 | SW2.2 103.9,17.8
  other vias: 58.3,8 92.2,4.1 105.2,35.4 88,14.7 79.3,20.1 115.8,6.6 60.3,43.4 91.3,36.2 108,35.3 115.2,17.2 104.4,13.6 74.8,27.8 100.9,14.7 73.9,19.2 55.1,27.7 11.4,18.2 94.8,14.3 102.3,4.6 93.2,32.1 112.9,24.8 96.7,21.2 77.5,18.6 60.4,39.6 42.4,17.2 90.8,14.8 99.1,17.5 44.5,4.9 88.2,7.3 115.1,9.9 55.4,18.5 93.1,27.3 39.3,9.2 75.4,29.3 67.3,28.5 64.2,17 44,8.1 52.6,17.3 77.9,41.8 56.7,43.3 55.3,39.2 70.4,42 62.3,24.8 88.2,33.4 78.6,38.8 108.8,26.3 100.5,21.8 77.8,10.1 89.8,33.1 86,26.9 67,11.3 62.9,11.1 73.5,3.4 60,3.5 67.4,6.6 62.6,17.9 113.9,17.6 76.3,44.3 104.2,26.3 73.8,7 67.9,21.6 109,28.4 115.4,32.6 114.1,35.5 73.3,38.4 64.1,36.9
  pour Top (isolate 0.4): 118.3,-0.1 118.3,48.1 -0.1,48.1 -0.1,-0.1
  pour Bottom (isolate 0.4): 118.2,-0.1 118.1,48.2 -0.3,48.3 -0.2,0
IRQ  (via drill 0.4)
  Top 0.305: v69.9,19.5 IC1.26 | v65.2,13.8 61.9,13.8 61.9,13.7 60.7,12.5 59.9,12.5 59,13.4 59,15.5 58.4,16.1 IRQ.1
  Bottom 0.305: v69.9,19.5 68.3,19.5 66.4,21.4 66.4,24.2 65.9,24.7 64.7,24.7 64.3,24.3 64.3,20.1 66.2,18.2 66.2,16.9 65.2,15.9 v65.2,13.8
LEFT  (via drill 0.4)
  Top 0.305: v80.6,10.4 80.7,10.5 IC1.43
  Bottom 0.305: v80.6,10.4 88.5,10.4 97.2,19.1 100.52,19.1 102.8,21.4 102.86,21.46 SW2.1
MISO  (via drill 0.4)
  Top 0.305: v66.3,12.7 62.2,12.7 61.2,11.7 59.7,11.7 58.4,13 58.4,13.7 57.9,14.2 MISO.1 | v76.6,15.4 78.3,15.4 79,16.1 80.8,16.1 82.2,14.7 IC1.2 84.8,14.7 85.4,14.1 v85.4,7.2
  Bottom 0.305: v66.3,12.7 66.3,15.8 67,16.5 75.5,16.5 v76.6,15.4 | ISP.1 83.7,3.57 83.7,5.8 85.1,7.2 v85.4,7.2
MOSI
  Top 0.305: 80.9,8.8 77.5,5.4 66.5,5.4 61.1,10.8 59.7,10.8 58.2,12.3 MOSI.1 | 80.9,8.8 83.3,11.2 IC1.1 | ISP.4 81.07,8.8 80.9,8.8
N$1
  Top 0.305: T2.1 71.3,25 70.9,24.6 R10.1 R9.2
N$2
  Top 0.305: IC1.8 86.5,19.5 86.5,21.8 89.2,21.8 C2.2 Q1.1
N$3
  Top 0.305: IC1.7 87.6,18.7 Q1.3 87.8,17.9 91.4,17.9 C1.2
N$4
  Top 0.305: IC1.13 80.7,24.7 81.3,25.3 83.1,25.3 84.3,26.5 R5.2
N$5
  Top 0.305: IC1.14 79.9,24.7 81.1,25.9 81.7,25.9 82.5,26.7 R4.2
N$6
  Top 0.305: IC1.15 79.1,24.9 80.7,26.5 R3.2
N$7
  Top 0.305: IC1.16 78.3,25.1 78.9,25.7 R2.2
N$8  (via drill 0.4)
  Top 0.305: v78.9,31.4 R2.1
  Bottom 0.305: LED1.K 70.83,33.33 71.2,33.7 76.6,33.7 v78.9,31.4
N$9  (via drill 0.4)
  Top 0.305: v80.7,31.4 R3.1
  Bottom 0.305: LED2.K 65.53,33.33 66.5,34.3 77.8,34.3 v80.7,31.4
N$10  (via drill 0.4)
  Top 0.305: v82.5,31.5 R4.1
  Bottom 0.305: LED3.K 60.23,33.13 62.2,35.1 78.9,35.1 v82.5,31.5
N$11  (via drill 0.4)
  Top 0.305: R5.1 84.3,30.6 84.1,30.8 84.1,32.5 v83.9,32.7
  Bottom 0.305: LED4.K 54.83,32.93 57.6,35.7 79.3,35.7 82.3,32.7 v83.9,32.7
N$12
  Top 0.305: R10.2 69.7,21 70.4,20.3 IC1.25
N$13
  Top 0.305: C7.1 69,18.7 | 69,18.7 68.8,18.7 C7.1 | 69,18.7 IC1.27 | C7.1 68.8,18.2 | L1.1 66.6,18.6 C7.1
N$14
  Top 0.305: C11.2 L2.2 3V.1
N$15
  Top 0.305: D1.2 72.1,8.8 74.3,11 IC1.35
N$17  (via drill 0.4)
  Top 0.305: R6.2 R7.1 v65.4,23.7 | IC1.30 73.5,16.3 v74.8,17.6
  Bottom 0.305: v74.8,17.6 69.1,17.6 65.4,21.3 R7.1 v65.4,23.7
N$18
  Top 0.305: R11.1 99.9,33.4 100.4,33.9 T1.1 100.5,34.65 100.5,34.8 102.4,34.8 R8.2
N$19
  Top 0.305: IC2.16 114.97,24.03 114.2,24.8 114.2,28.2 115,29 115,29.9 114.2,30.7 X1.D-
N$20
  Top 0.305: IC1.29 70.2,17.1 C6.1
N$21
  Top 0.305: C9.2 106.8,30.4 107.7,29.5
  Top 0.5: X1.VBUS 108.1,29.9 107.7,29.5 107.3,29.1 L3.1
N$22
  Top 0.305: IC2.15 115.62,24.38 114.9,25.1 114.9,28.1 115.6,28.8 115.6,30.6 114.6,31.5 X1.D+
N$24
  Top 0.406: 58.9,34.9 58.9,34.2 58,34.5 58.9,34.9
N$25  (via drill 0.4)
  Top 0.305: IC1.24 73.9,21.1 v74.7,21.9
  Bottom 0.305: v74.7,21.9 73.5,20.7 71.9,20.7 71.6,21 71.6,21.6 PAD1.1
N$26  (via drill 0.4)
  Top 0.305: IC1.23 73.3,21.9 v73.5,22.1
  Bottom 0.305: v73.5,22.1 73.5,23.3 73,23.8 PAD2.1
N$27  (via drill 0.4)
  Top 0.305: v73.5,25.7 IC1.22
  Bottom 0.305: v73.5,25.7 71.3,25.7 PAD3.1
N$28  (via drill 0.4)
  Top 0.305: IC1.21 74.3,24.9 74.7,25.3 74.7,26.6 73.7,26.6 v73.1,27.2
  Bottom 0.305: PAD4.1 v73.1,27.2
N$29
  Bottom 0.406: 58,34.5 58.9,34.2 58.9,34.9 58,34.5
N$30
  Top 0.2: R14.2 67.1,42.5 67.4,42.2 67.6,42 IC3.18
N$31
  Top 0.2: R15.1 67,40.9 67.6,41.5 67.7,41.6 IC3.19
N$32
  Top 0.305: D3.C R15.2
N$33
  Top 0.305: R17.1 57.7,20.95 IC4.1
N$35  (via drill 0.4)
  Top 0.2: IC3.4 70.8,39.7 71.4,39.1 v72,39.1
  Top 0.305: R21.2 R13.1 74.35,47 C13.1 v70.9,47
  Bottom 0.305: v72,39.1 72.5,39.1 73.1,39.7 73.1,42.8 70.9,45 v70.9,47
N$36
  Top 0.2: IC3.6 72.4,41.2 72.5,41.1
  Top 0.305: 72.5,41.1 74.3,41.1 74.9,40.5 L5.P$3
POWER_OFF  (via drill 0.4)
  Top 0.305: v67.7,26.9 T2.3 | v60.2,24.7 60.2,26.62 IC4.6
  Bottom 0.305: v67.7,26.9 62.4,26.9 v60.2,24.7
POWER_ON
  Top 0.305: D2.2 58.97,29 IC4.7
PWREN  (via drill 0.4)
  Top 0.305: R12.1 114.9,12.6 115.62,13.32 IC2.14 116.7,15.04 v116.6,15.1 | v104.6,36.8 R8.1
  Bottom 0.305: v116.6,15.1 116.6,36.8 v104.6,36.8
RIGHT  (via drill 0.4)
  Top 0.305: v80.7,14.3 79.9,13.5 IC1.42
  Bottom 0.305: v80.7,14.3 84.98,14.3 SW3.1
RST
  Top 0.305: 102.4,16.4 R1.1 102.4,16.3 89.4,16.3 | 89.4,16.3 IC1.4 | ISP.5 89.4,4.19 89.4,16.3
RXD  (via drill 0.4)
  Top 0.305: IC1.9 85.7,20.3 85.7,22.6 86.7,23.6 v99.8,23.6 | v105.9,14.3 106.58,15.03 IC2.1
  Bottom 0.305: v105.9,14.3 111.6,14.3 112.5,15.2 112.5,22.3 110.7,24.1 103.3,24.1 102.8,23.6 v99.8,23.6
SCK
  Top 0.305: IC1.3 85.5,15.5 86.9,14.1 86.9,6.6 86.3,6 86.3,3.63 ISP.3 83.73,3.6 81.5,3.6 80.5,4.6 62.5,4.6 61,6.1 61,8.5 59.1,10.4 SCK.1
SELECT  (via drill 0.4)
  Top 0.305: IC1.34 68.1,12.1 v67.7,12.6
  Bottom 0.305: v67.7,12.6 67.7,15.18 SW5.1
START  (via drill 0.4)
  Top 0.305: D1.1 67.5,8.8 v64.9,11.5 | D2.1 54.5,29 52.9,27.4 52.9,19.3 v53.4,18.8
  Bottom 0.305: v64.9,11.5 64.7,11.64 60.1,16.24 57,16.24 | 57,16.24 55.9,16.24 v53.4,18.8 | SW6.1 57.06,16.18 57,16.24
TXD  (via drill 0.4)
  Top 0.305: IC1.10 84.9,21.1 84.9,23.4 86.3,24.8 v102.3,24.8 | v114.1,19.4 112.8,19.4 109.78,16.38 IC2.5
  Bottom 0.305: v102.3,24.8 111,24.8 114.1,21.8 v114.1,19.4
UP  (via drill 0.4)
  Top 0.305: v79.5,14.6 79.1,14.2 IC1.41
  Bottom 0.305: SW1.1 93.86,30.46 93.6,30.2 86.12,22.7 84.8,22.7 82.4,20.3 82.4,15.7 81.9,15.2 80.1,15.2 v79.5,14.6
USBSENSE  (via drill 0.4)
  Top 0.305: v91.8,30.2 91.8,33 94.4,35.6 T1.3 | v75.8,19.8 75.8,17.3 74.9,16.4 74.9,14.7 74.1,13.9 IC1.33
  Bottom 0.305: v91.8,30.2 85,23.4 79.4,23.4 v75.8,19.8
VCC  (via drill 0.4)
  Top 0.2: 68.9,39.9 68.9,41.15 IC3.20 | IC3.16 68.95,43.05 v68.2,43.8
  Top 0.305: C5.2 104.7,31.3 v104.7,29.4 105.5,28.6 L3.2 105.5,25.8 106.4,24.9 106.4,21.3 106.9,20.8 112,20.8 112.38,21.18 IC2.20 | C14.2 v68.9,37.1 68.9,37.8 68.9,38.9 | 68.9,38.9 68.9,39.5 | 68.9,39.5 v68.7,39.7 | v68.7,39.7 68.9,39.9 | 68.9,39.5 v68.7,39.7 | 68.9,38.9 D3.A
  Top 0.5: L3.2 104.9,27.8 104.3,28.4 103,28.4 C4.+
  Bottom 0.305: v104.7,29.4 104.7,30.4 100.3,34.8 86,34.8 81.3,34.8 79.6,36.5 72.7,36.5 69.5,36.5 v68.9,37.1 | v68.2,43.8 68.7,43.3 v68.7,39.7
VCCIO
  Top 0.305: IC2.17 114.33,20.93 113.6,20.2 112.7,20.2 109.12,16.62 IC2.4 109.12,12.92 C8.1 R12.2

### Text on the board
tNames: GND | Q1 | IRQ | PentaWall GamePad v0.3.0 | MISO | MOSI | SCK | CSN | CE | 3V
tStop: BAT | GND | seb@exse.net
bStop: <<</>> | seb@exse.net
tDocu: Vout | GND | Vbat | GND | Vin | GND | ON_SW | OFF_SW